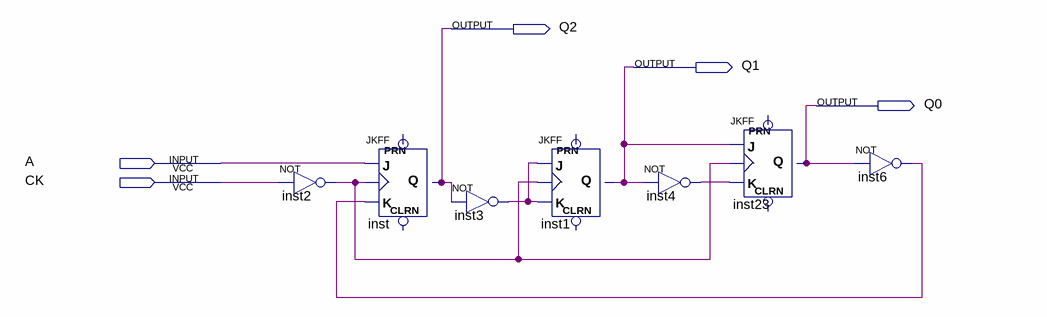
[diagram p0: schematic sheet]
// Quartus schematic Q7.bdf as structural Verilog: 7 symbols, 5 pins
module Q7 (
  input  A,
  input  CK,
  output Q2,
  output Q1,
  output Q0
);

  wire inst2_out, inst3_out, inst4_out, inst6_out;

  not inst2 (inst2_out, CK);
  JKFF inst (.K(inst6_out), .J(A), .CLK(inst2_out), .Q(Q2));  // open: PRN, CLRN
  not inst3 (inst3_out, Q2);
  JKFF inst1 (.K(inst3_out), .J(inst3_out), .CLK(inst2_out), .Q(Q1));  // open: PRN, CLRN
  not inst4 (inst4_out, Q1);
  JKFF inst23 (.K(inst4_out), .J(Q1), .CLK(inst2_out), .Q(Q0));  // open: PRN, CLRN
  not inst6 (inst6_out, Q0);
endmodule
